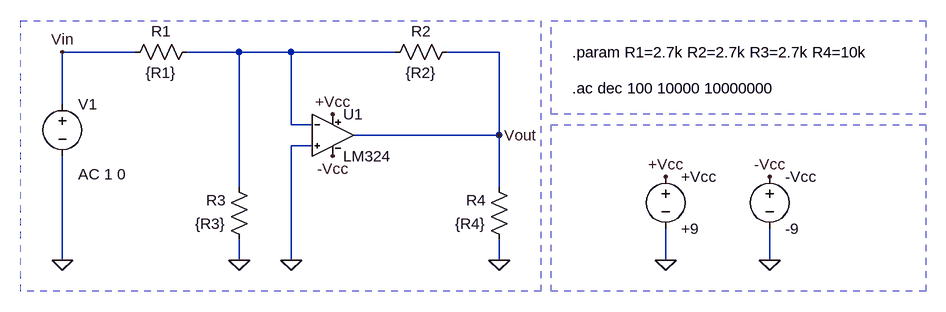
[diagram p0: schematic InversorCaso2.asc]
InversorCaso2.asc, the LTspice schematic file:
Version 4
SHEET 1 1188 680
WIRE -96 32 -208 32
WIRE 64 32 -16 32
WIRE 144 32 64 32
WIRE 304 32 144 32
WIRE 464 32 384 32
WIRE -208 112 -208 32
WIRE 144 144 144 32
WIRE 176 144 144 144
WIRE 464 160 464 32
WIRE 464 160 240 160
WIRE 176 176 144 176
WIRE 64 240 64 32
WIRE 464 240 464 160
WIRE -208 352 -208 192
WIRE 64 352 64 320
WIRE 144 352 144 176
WIRE 464 352 464 320
WIRE 720 352 720 304
WIRE 880 352 880 304
FLAG -208 352 0
FLAG 64 352 0
FLAG 144 352 0
FLAG 464 352 0
FLAG 464 160 Vout
FLAG 208 128 +Vcc
FLAG 208 192 -Vcc
FLAG -208 32 Vin
FLAG 720 352 0
FLAG 880 352 0
FLAG 720 224 +Vcc
FLAG 880 224 -Vcc
SYMBOL FACUsym\\LM324 208 160 R0
SYMATTR InstName U1
SYMBOL voltage -208 96 R0
WINDOW 123 24 124 Left 2
WINDOW 39 0 0 Left 0
SYMATTR Value2 AC 1 0
SYMATTR InstName V1
SYMATTR Value ""
SYMBOL res 0 16 R90
WINDOW 0 0 56 VBottom 2
WINDOW 3 32 56 VTop 2
SYMATTR InstName R1
SYMATTR Value {R1}
SYMBOL res 400 16 R90
WINDOW 0 0 56 VBottom 2
WINDOW 3 32 56 VTop 2
SYMATTR InstName R2
SYMATTR Value {R2}
SYMBOL res 480 336 R180
WINDOW 0 36 76 Left 2
WINDOW 3 36 40 Left 2
SYMATTR InstName R4
SYMATTR Value {R4}
SYMBOL res 80 336 R180
WINDOW 0 36 76 Left 2
WINDOW 3 36 40 Left 2
SYMATTR InstName R3
SYMATTR Value {R3}
SYMBOL voltage 720 208 R0
SYMATTR InstName +Vcc
SYMATTR Value +9
SYMBOL voltage 880 208 R0
SYMATTR InstName -Vcc
SYMATTR Value -9
TEXT 576 32 Left 2 !.param R1=2.7k R2=2.7k R3=2.7k R4=10k
TEXT 576 88 Left 2 !.ac dec 100 10000 10000000
RECTANGLE Normal 528 400 -272 -16 2
RECTANGLE Normal 1120 128 544 -16 2
RECTANGLE Normal 1120 400 544 144 2

The netlist it stands for:
* InversorCaso2.asc
XU1 0 N001 +Vcc -Vcc Vout LM324 LM324  ; pins In+ In- V+ V- OUT
V1 Vin 0 AC 1 0
R1 N001 Vin {R1}
R2 Vout N001 {R2}
R4 0 Vout {R4}
R3 0 N001 {R3}
V§+Vcc +Vcc 0 +9
V§-Vcc -Vcc 0 -9
.param R1=2.7k R2=2.7k R3=2.7k R4=10k
.ac dec 100 10000 10000000
.lib FACUsub/LM324.lib
.backanno
.end